# EasyEDA Pro project PCIE拆分卡.epro, schematic Schematic1

## Sheets
1 Gold_X16: Create Date: 2024-06-08; Page Name: Gold_X16; Project Name: P9D_IX_PCIEx16_x8x8; Schematic Name: Schematic1; Update Date: 2024-06-13; Company: 嘉立创EDA; Page Size: A4; Version: V1.0
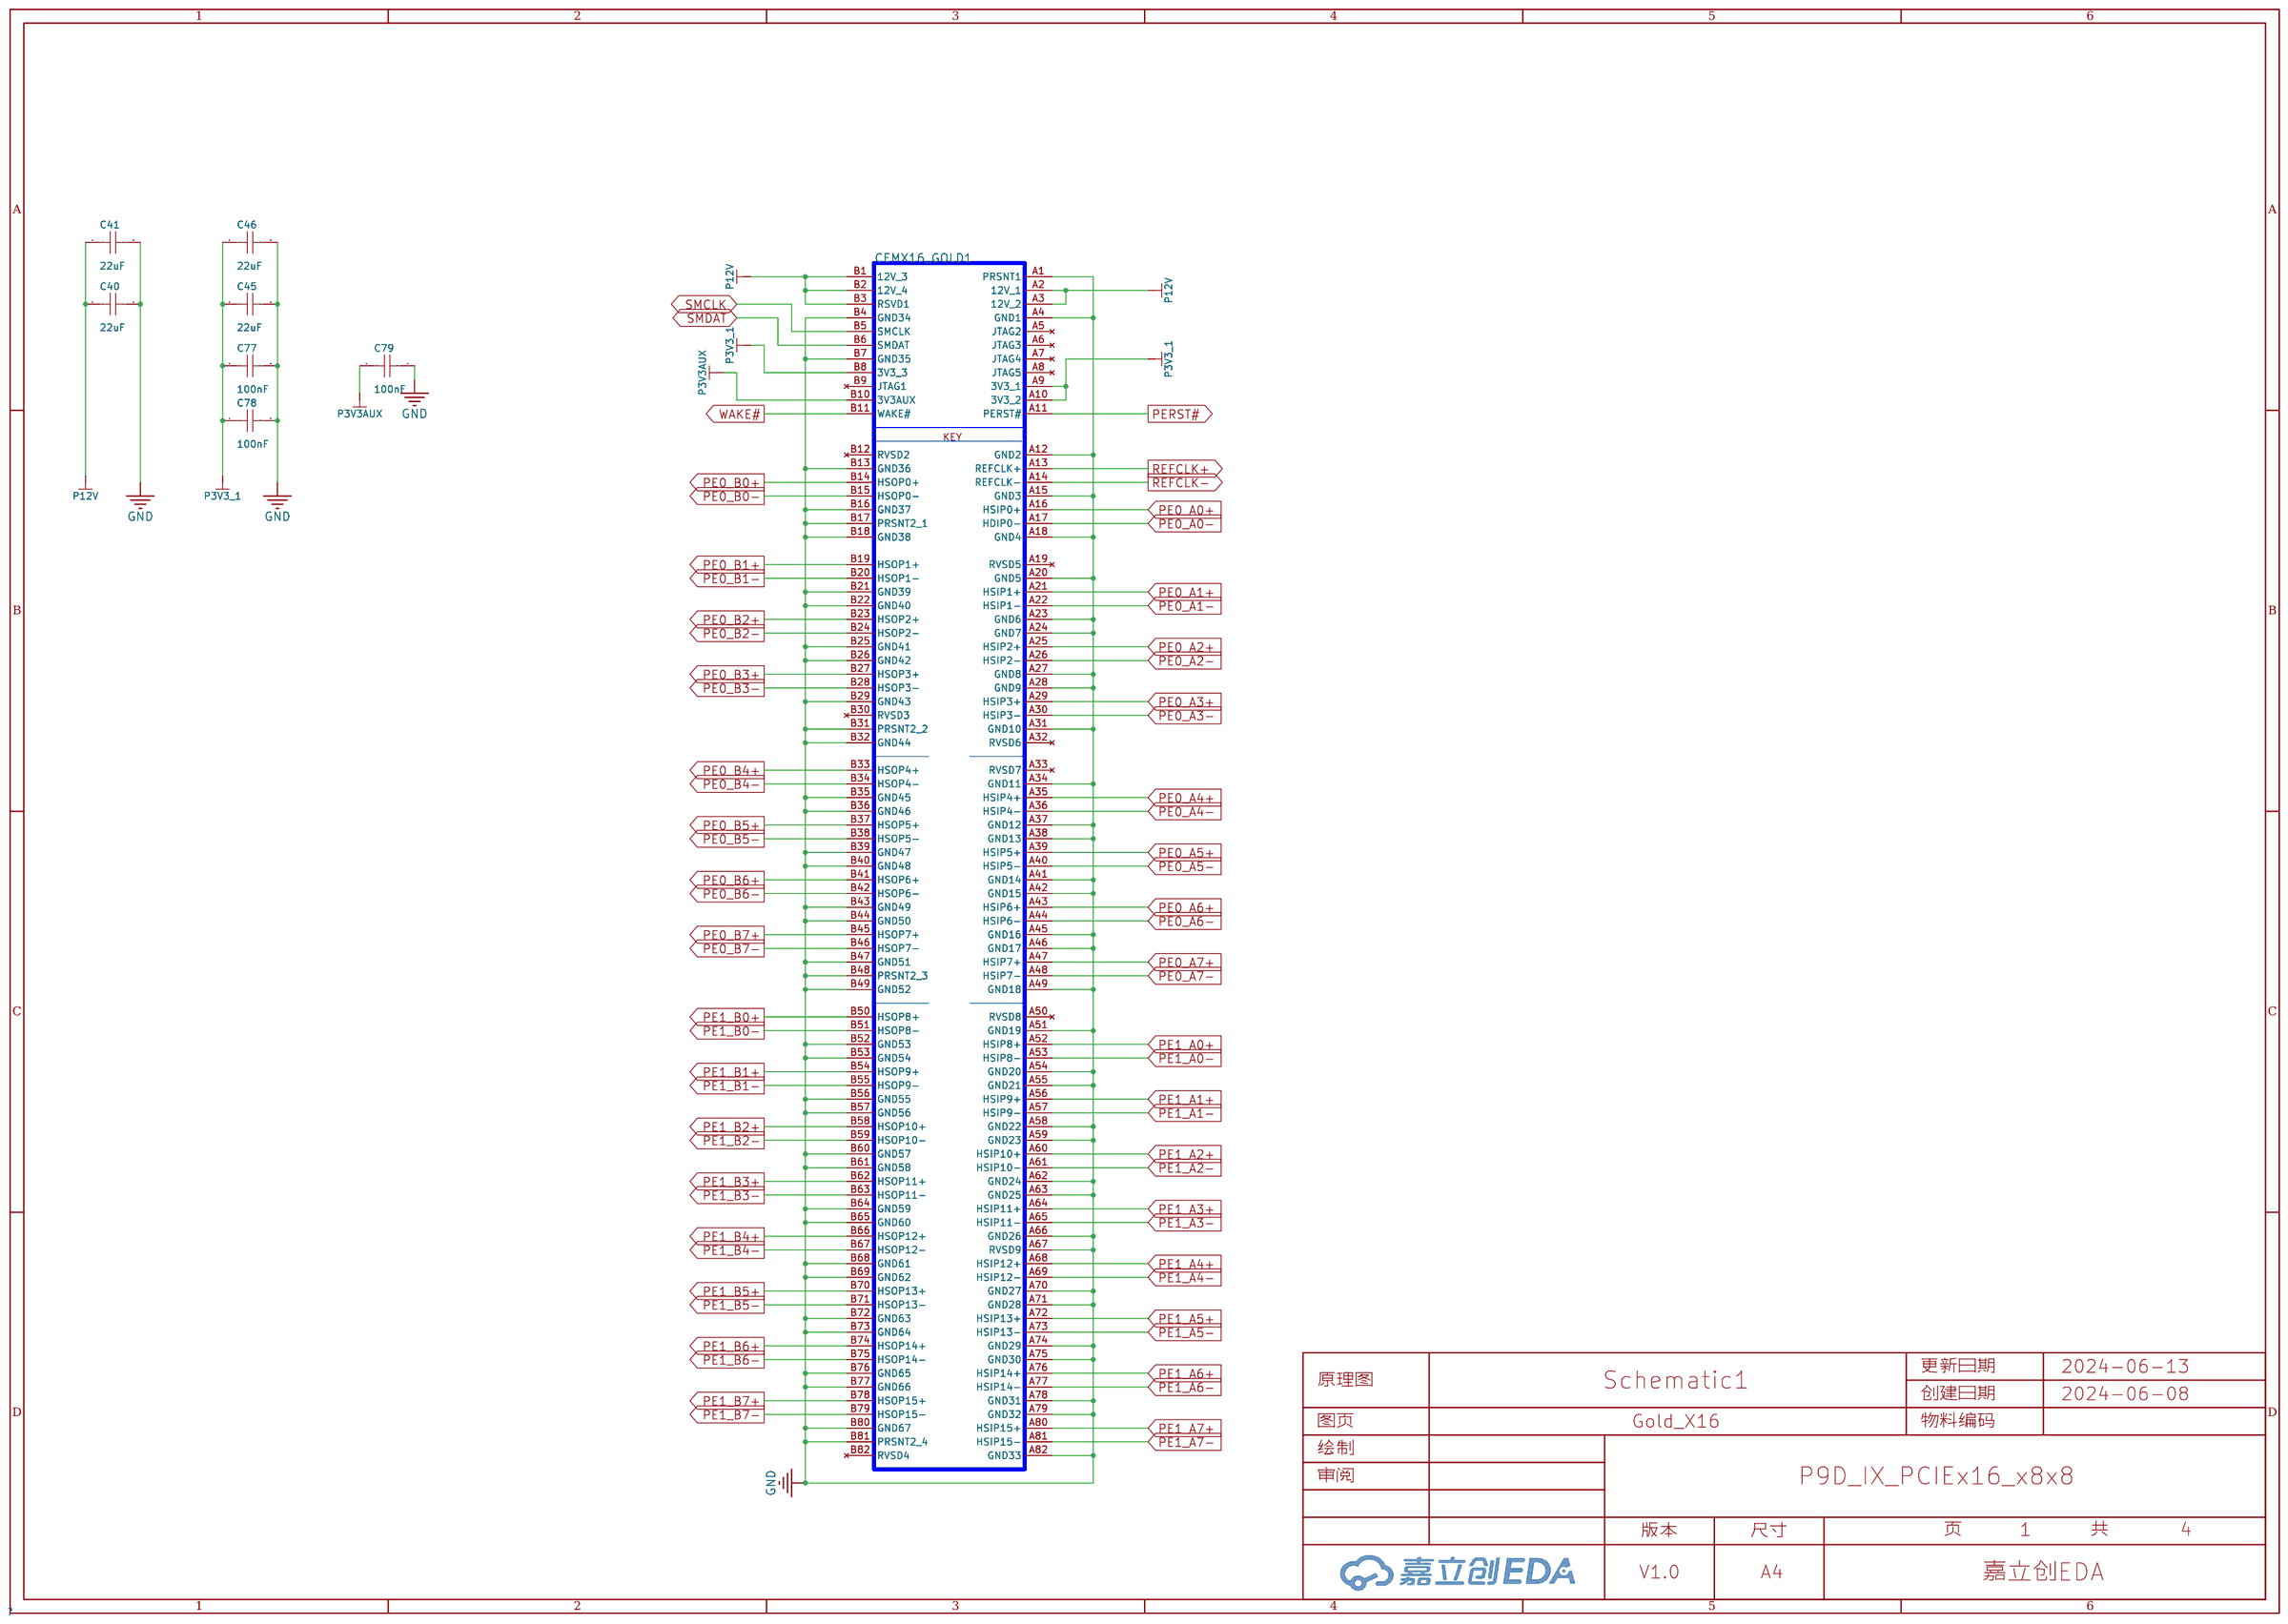
[diagram p0: Gold_X16]
2 CLK: Page Name: CLK; Update Date: 2024-06-12
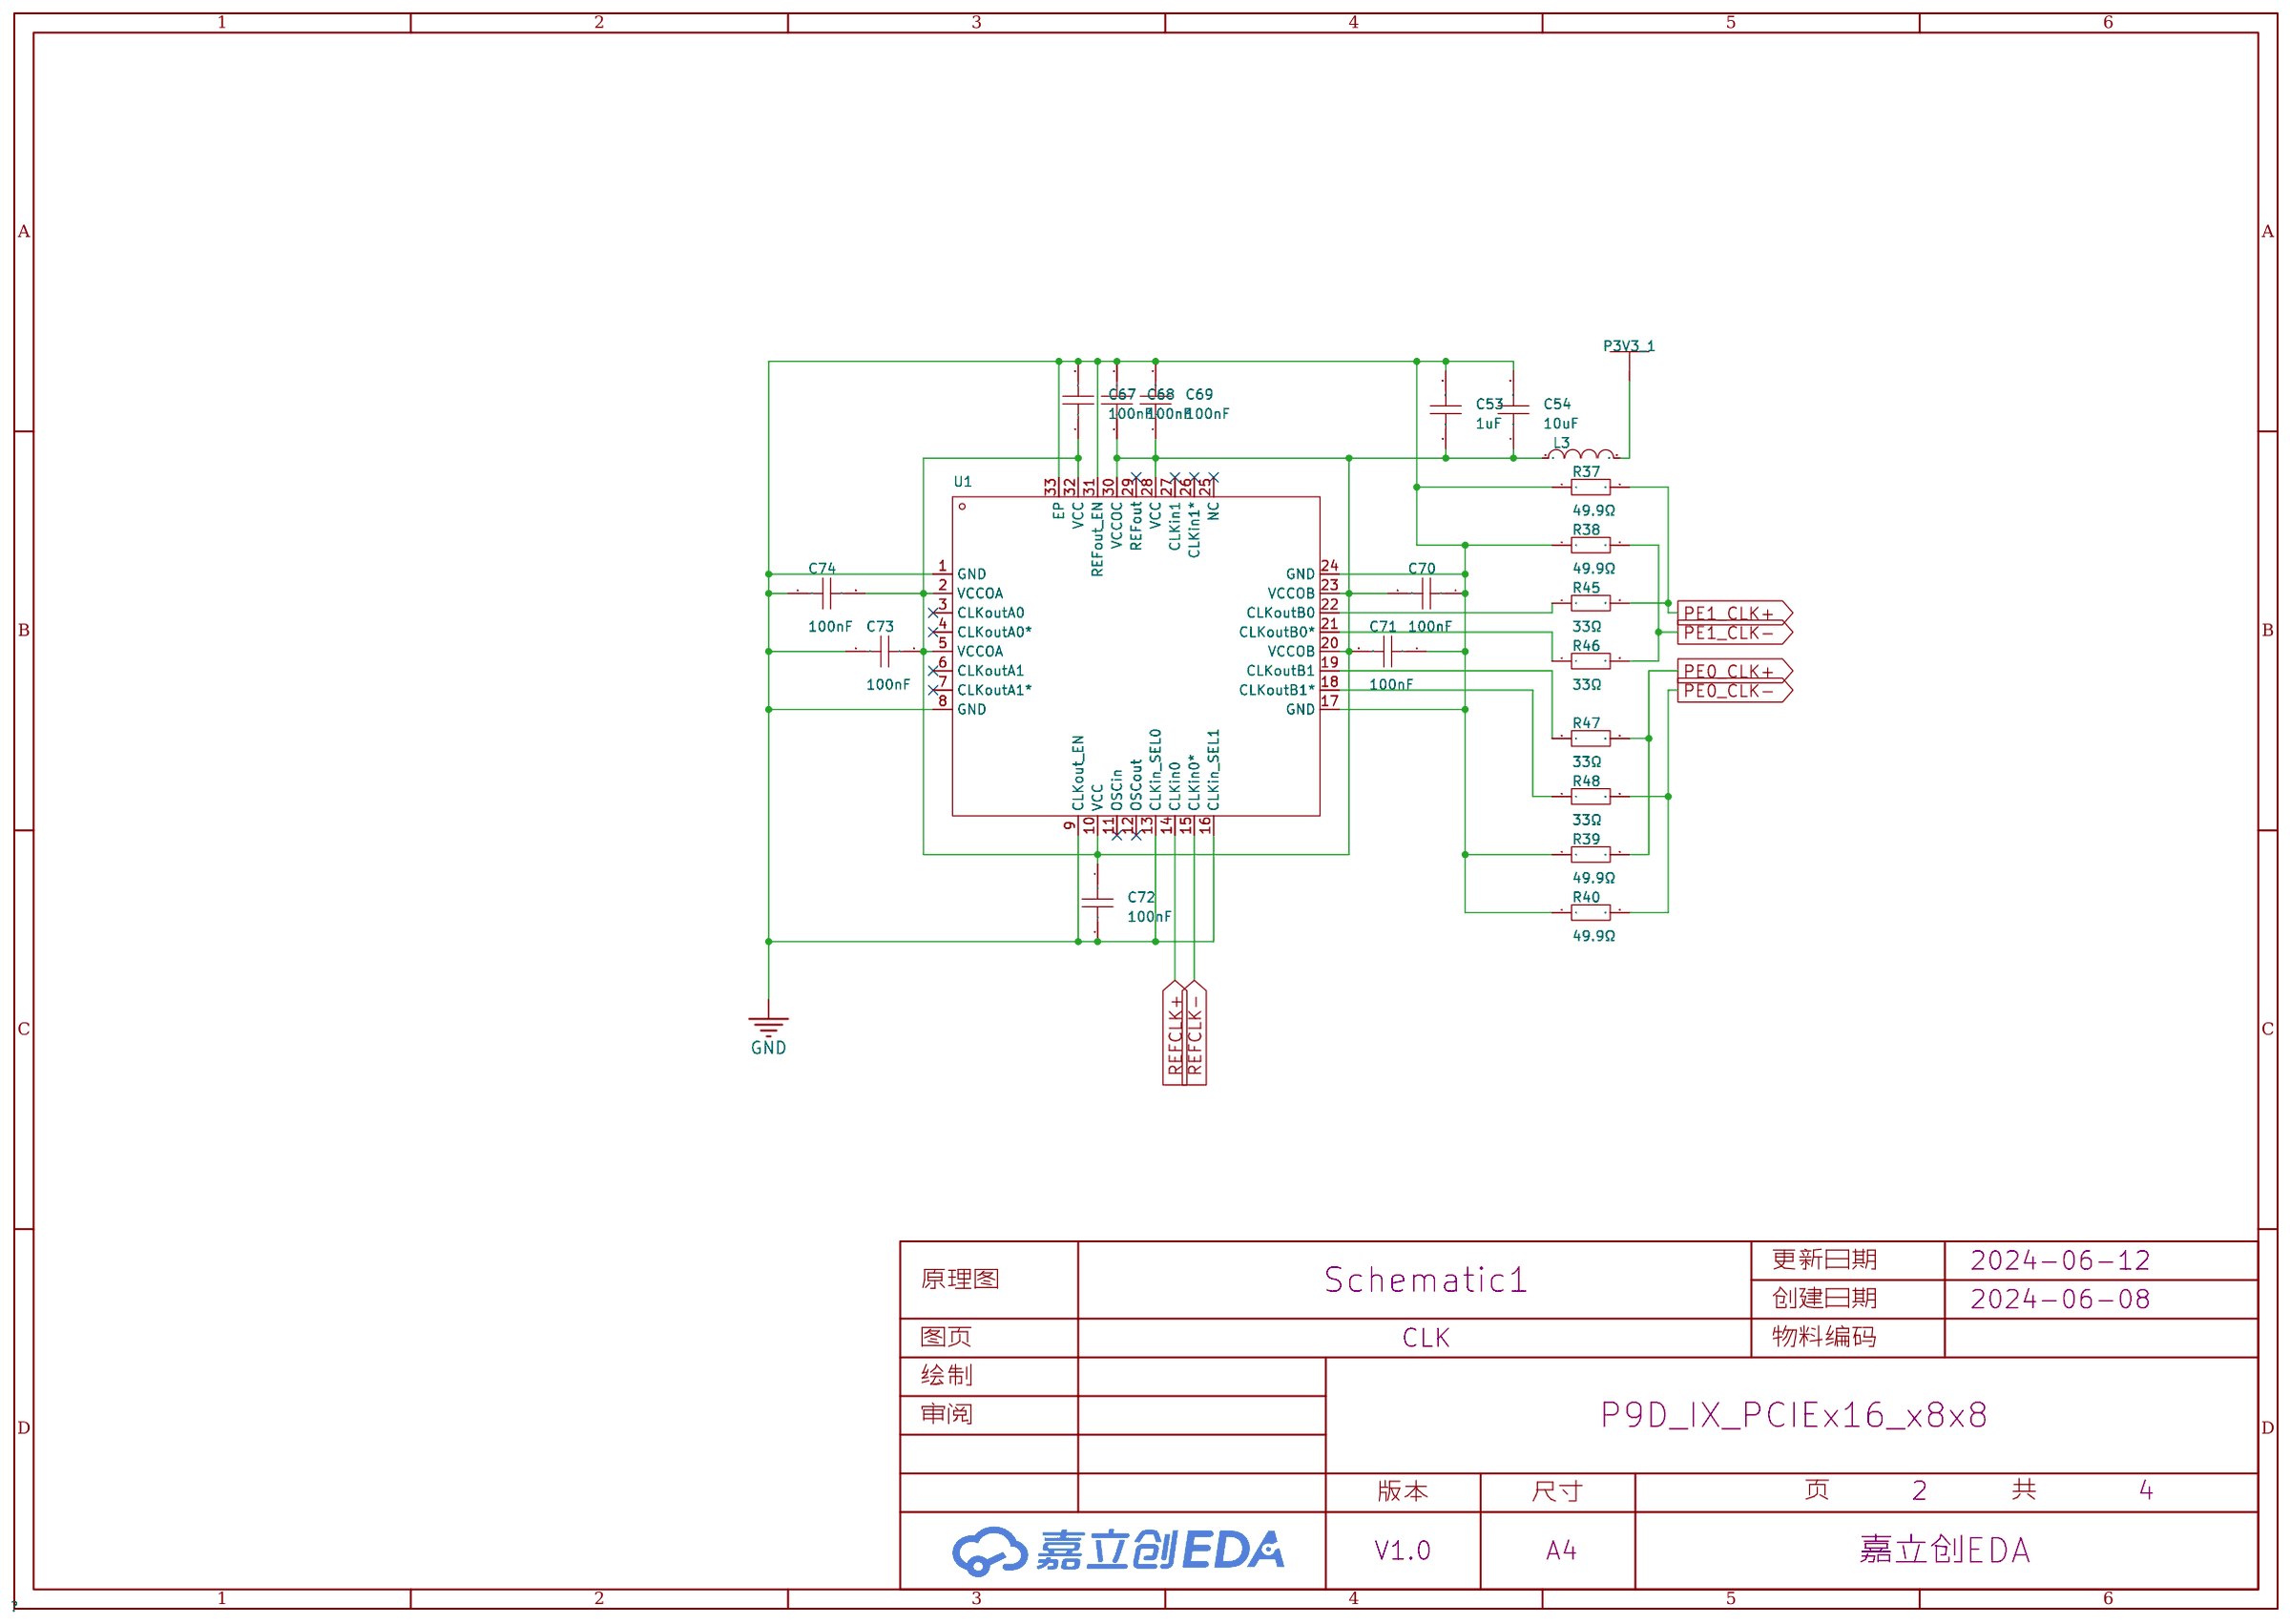
[diagram p1: CLK]
3 PCIEx8_1: Page Name: PCIEx8_1; Update Date: 2024-06-08
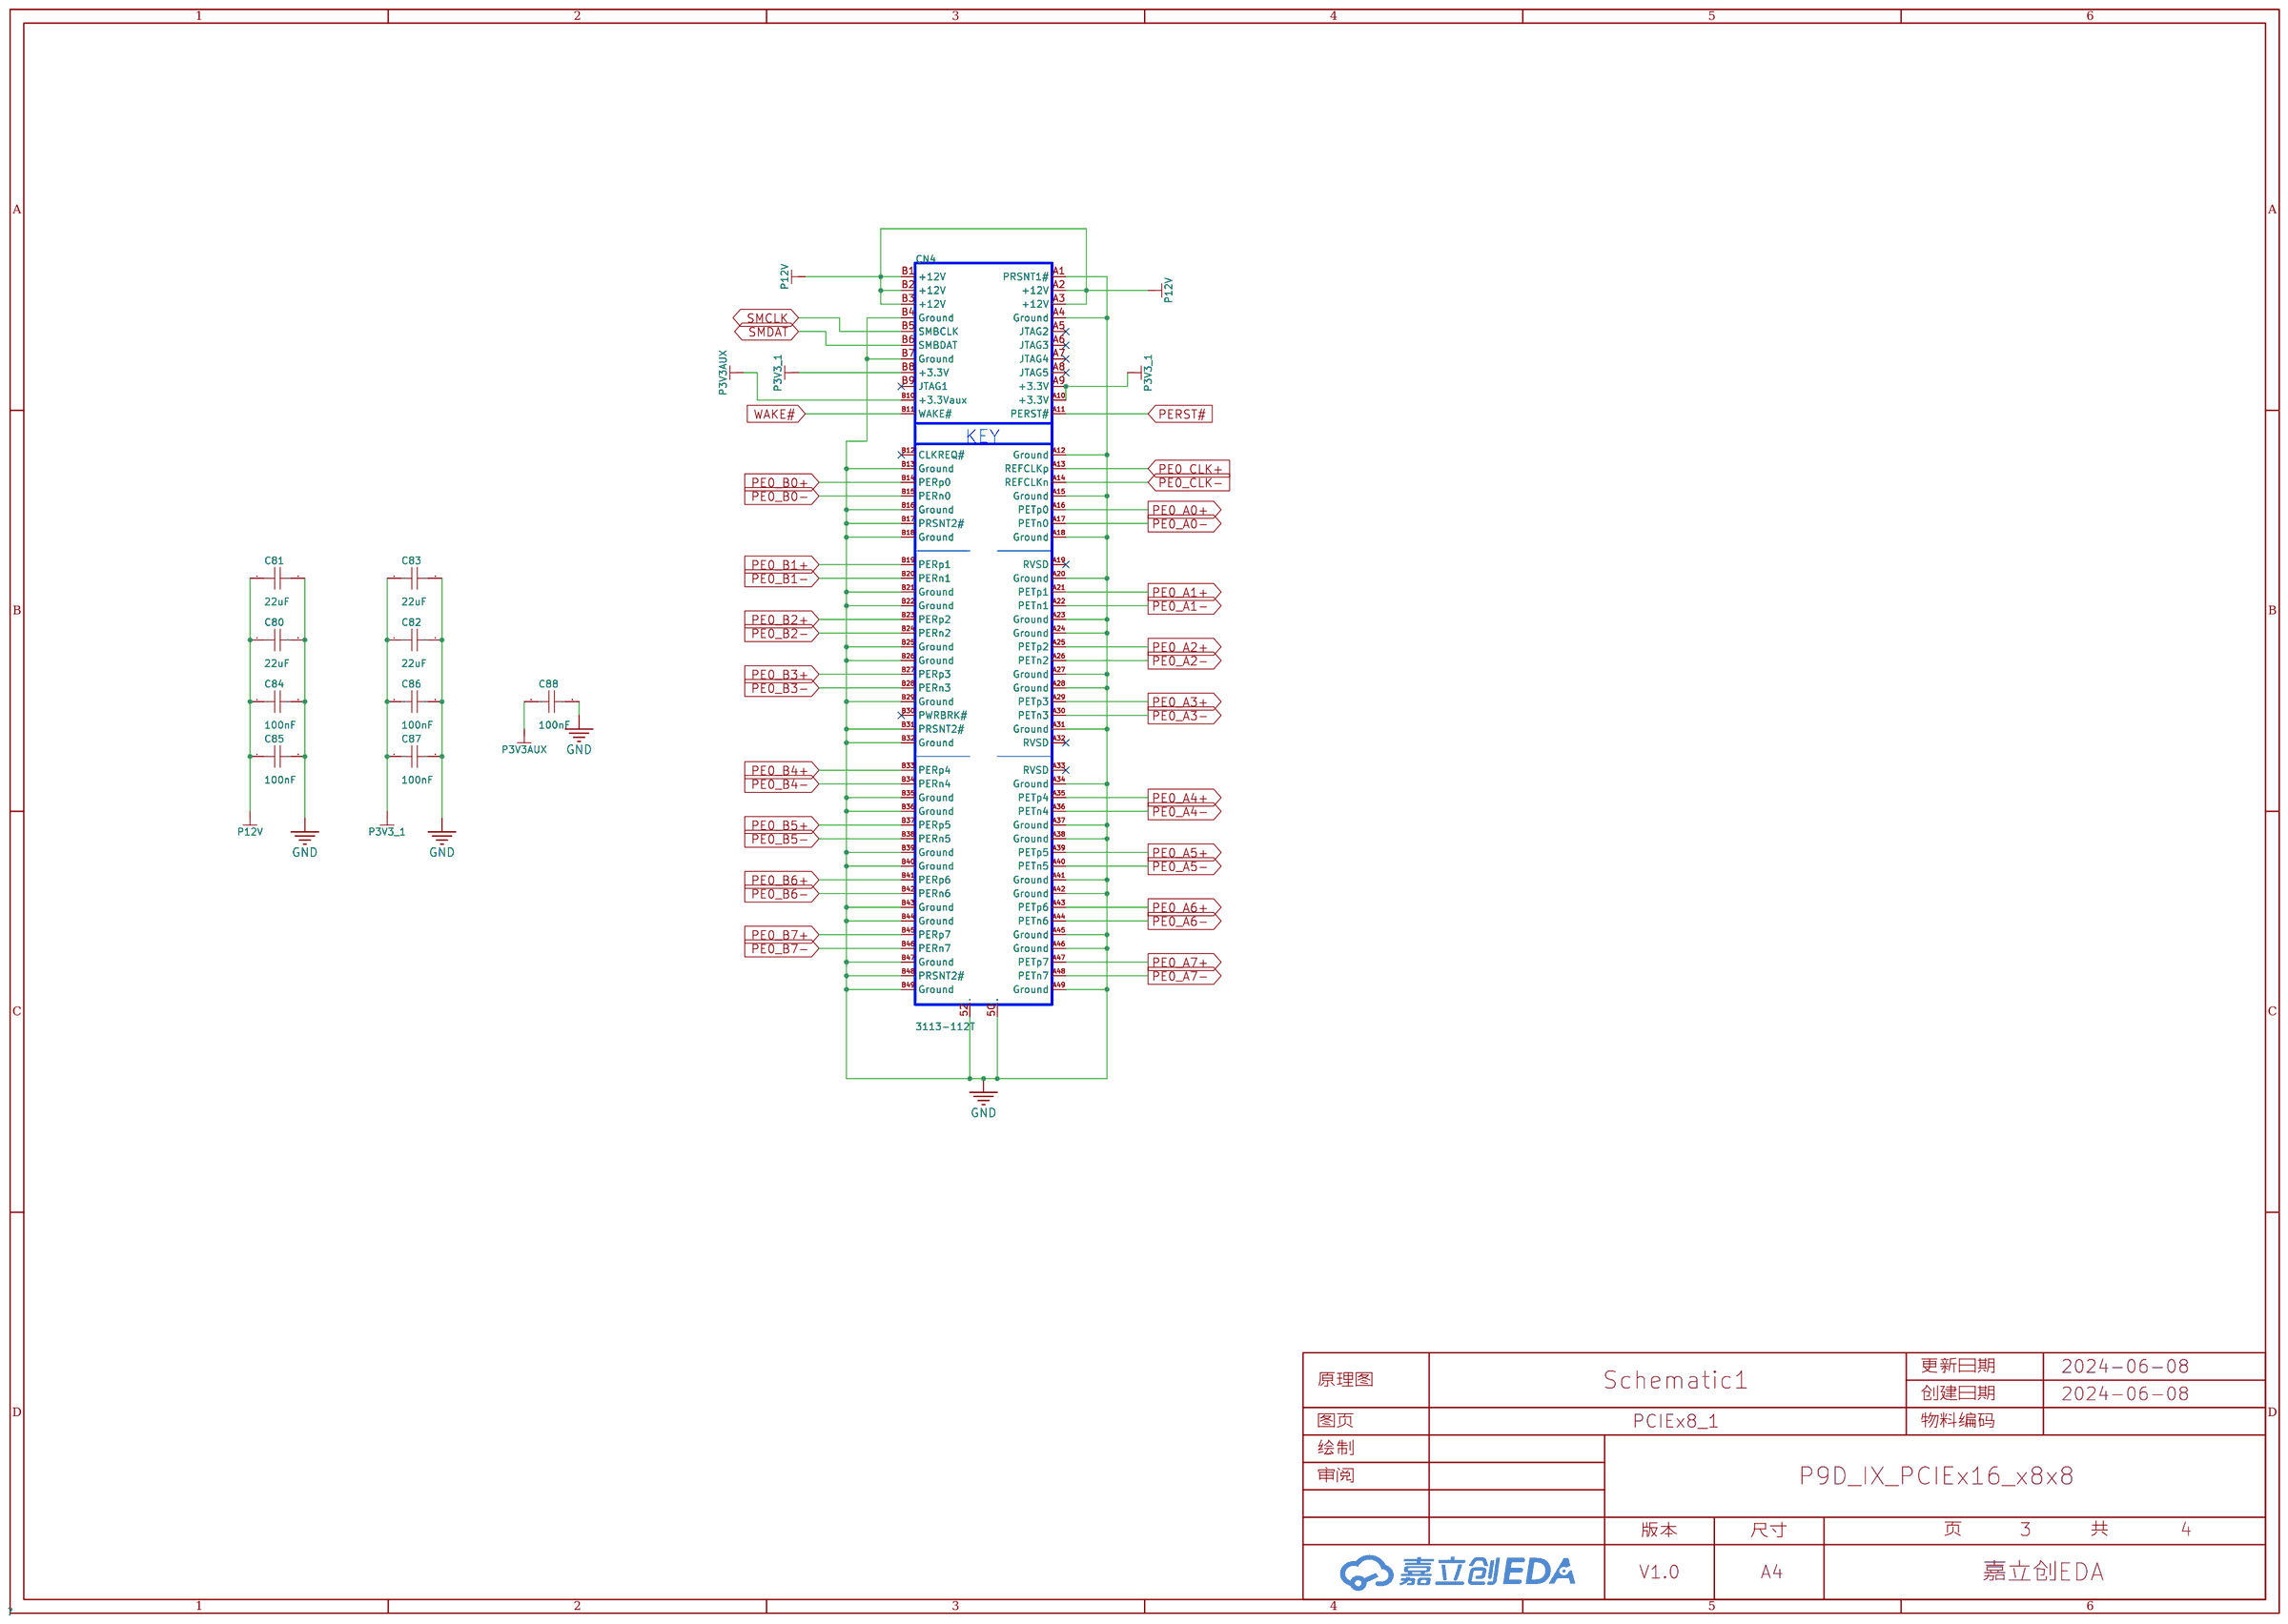
[diagram p2: PCIEx8_1]
4 PCIEx8_2: Page Name: PCIEx8_2; Update Date: 2024-06-08
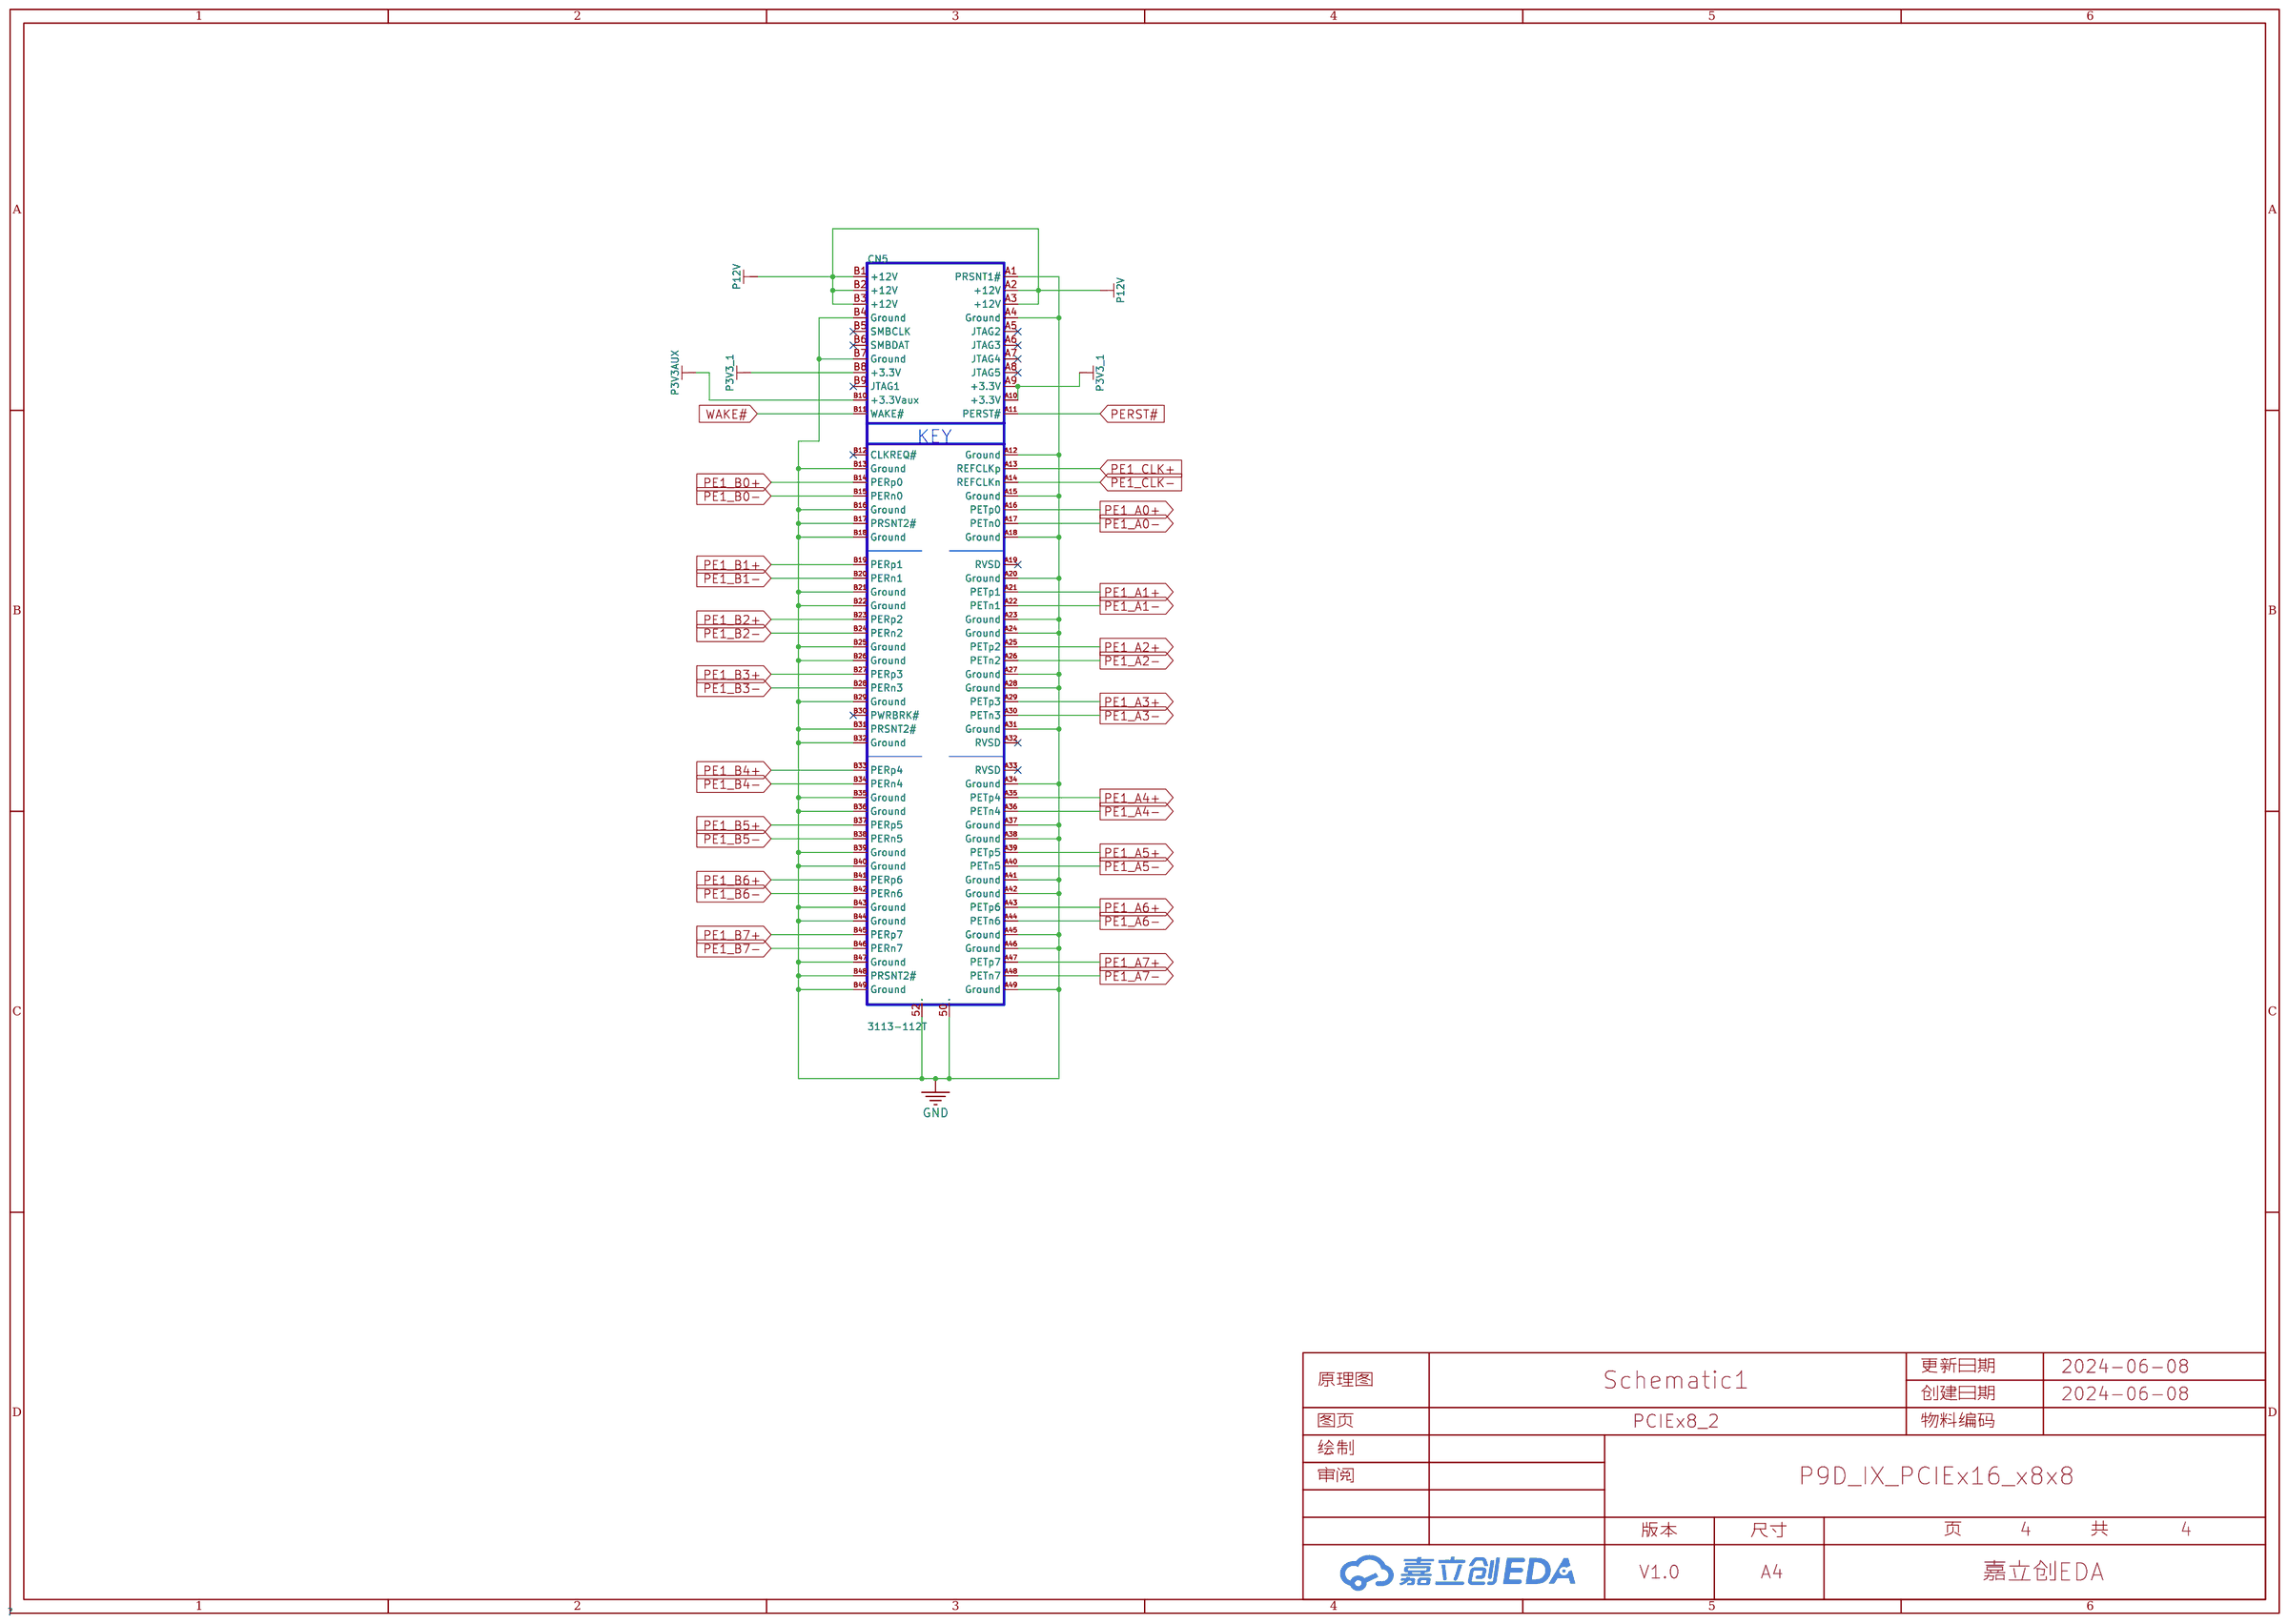
[diagram p3: PCIEx8_2]

## Parts
sheet CLK
C53  1uF  [C0603]
C54  10uF  [C0603]
C67  100nF  [C0402]
C68  100nF  [C0402]
C69  100nF  [C0402]
C70  100nF  [C0402]
C71  100nF  [C0402]
C72  100nF  [C0402]
C73  100nF  [C0402]
C74  100nF  [C0402]
L3  -  [L0805]
R37  49.9Ω  [R0402]
R38  49.9Ω  [R0402]
R39  49.9Ω  [R0402]
R40  49.9Ω  [R0402]
R45  33Ω  [R0402]
R46  33Ω  [R0402]
R47  33Ω  [R0402]
R48  33Ω  [R0402]
U1  -  [WQFN-32_L5.0-W5.0-P0.50-BL-EP]
sheet Gold_X16
C40  22uF  [C0805]
C41  22uF  [C0805]
C45  22uF  [C0805]
C46  22uF  [C0805]
C77  100nF  [C0603]
C78  100nF  [C0603]
C79  100nF  [C0603]
CEMX16_GOLD1  -  [PCIEX16_GOLD]  (no BOM)
sheet PCIEx8_1
C80  22uF  [C0805]
C81  22uF  [C0805]
C82  22uF  [C0805]
C83  22uF  [C0805]
C84  100nF  [C0603]
C85  100nF  [C0603]
C86  100nF  [C0603]
C87  100nF  [C0603]
C88  100nF  [C0603]
CN4  3113-112T  [CONN-SMD_98P-P1.00-V_3133]
sheet PCIEx8_2
CN5  3113-112T  [CONN-SMD_98P-P1.00-V_3133]

## Library data of the parts
C53 = CL10A105KB8NNNC: 容值:1uF;精度:±10%;额定电压:50V;材质(温度系数):X5R;; LCSC Part Name: 1uF ±10% 50V; Supplier Part: C15849; Manufacturer: SAMSUNG(三星); Supplier Footprint: 0603; JLCPCB Part Class: Basic Part; Datasheet: https://atta.szlcsc.com/upload/public/pdf/source/20160218/1457707763339.pdf; Supplier: LCSC; Tolerance: ±10%; Voltage Rated: 50V; Temperature Coefficient: X5R
C54 = CL10A106KP8NNNC: 容值:10uF;精度:±10%;额定电压:10V;材质(温度系数):X5R;; LCSC Part Name: 10uF ±10% 10V; Supplier Part: C19702; Manufacturer: SAMSUNG(三星); Supplier Footprint: 0603; JLCPCB Part Class: Basic Part; Datasheet: https://atta.szlcsc.com/upload/public/pdf/source/20160218/1457707763339.pdf; Supplier: LCSC; Tolerance: ±10%; Voltage Rated: 10V; Temperature Coefficient: X5R
C67-C74 = CL05B104KO5NNNC: 容值:100nF;精度:±10%;额定电压:16V;材质(温度系数):X7R;; LCSC Part Name: 100nF ±10% 16V; Supplier Part: C1525; Manufacturer: SAMSUNG(三星); Supplier Footprint: 0402; JLCPCB Part Class: Basic Part; Datasheet: https://atta.szlcsc.com/upload/public/pdf/source/20160218/1457707763339.pdf; Supplier: LCSC; Tolerance: ±10%; Voltage Rated: 16V; Temperature Coefficient: X7R
L3 = PZ2012D800-3R0TF: 标称阻抗@测试频率:80Ω@100MHz;误差:±25%;直流电阻(RDC):0.04Ω;额定电流:3000mA;电路数:1;; LCSC Part Name: 80Ω@100MHz ±25%; Supplier Part: C12389; Manufacturer: Sunlord(顺络); Supplier Footprint: 0805; JLCPCB Part Class: 扩展库; Datasheet: https://atta.szlcsc.com/upload/public/pdf/source/20210816/2FE48A83668C9496AD98DE44B7F0FA96.pdf; Supplier: LCSC; Impedance @ Frequency: 80Ω@100MHz; Tolerance: ±25%; DC Resistance: 0.04Ω; Current Rating: 3000mA; Circuits: 1
R37-R40 = ERA2AEB49R9X: 电阻类型:薄膜电阻;阻值:49.9Ω;精度:±0.1%;功率:63mW;温度系数:±25ppm/℃;; LCSC Part Name: 49.9Ω ±0.1% 63mW 薄膜电阻; Supplier Part: C490832; Manufacturer: PANASONIC(松下); Supplier Footprint: 0402; JLCPCB Part Class: Extended Part; Datasheet: https://atta.szlcsc.com/upload/public/pdf/source/20200407/C490832_91E847F7316FF40FBA654E9B1D34990D.pdf; Supplier: LCSC; Type: 薄膜电阻; Tolerance: ±0.1%; Power(Watts): 63mW; Temperature Coefficient: ±25ppm/℃; Operating Temperature Range: -55℃~+155℃
R45-R48 = RT0402BRD0733RL: 电阻类型:薄膜电阻;阻值:33Ω;精度:±0.1%;功率:63mW;温度系数:±25ppm/℃;; LCSC Part Name: 薄膜电阻 33Ω ±0.1% 63mW; Supplier Part: C852729; Manufacturer: YAGEO(国巨); Supplier Footprint: 0402; JLCPCB Part Class: Extended Part; Datasheet: https://atta.szlcsc.com/upload/public/pdf/source/20200610/C326738_5639A9F1B6EB6E4AE2197577D3456E7F.pdf; Supplier: LCSC; Type: 薄膜电阻; Tolerance: ±0.1%; Power(Watts): 63mW; Temperature Coefficient: ±25ppm/℃; Operating Temperature Range: -55℃~+155℃
U1 = LMK00334RTVR: LMK00334 LMK00334 4 输出 PCIe Gen1/Gen2/Gen3 时钟缓冲器/电平转换器; Supplier Part: C201644; Manufacturer: TI(德州仪器); Supplier Footprint: WQFN-32; JLCPCB Part Class: Extended Part; Datasheet: https://atta.szlcsc.com/upload/public/pdf/source/20180329/C201644_E52AC8D9AC4553EBBD85BA4FA6BF53AD.pdf; Supplier: LCSC
C40 C41 C45 C46 C80-C83 = CL21A226MAQNNNE: 容值:22uF;精度:±20%;额定电压:25V;材质(温度系数):X5R;; LCSC Part Name: 22uF ±20% 25V; Supplier Part: C45783; Manufacturer: SAMSUNG(三星); Supplier Footprint: 0805; JLCPCB Part Class: Basic Part; Datasheet: https://atta.szlcsc.com/upload/public/pdf/source/20160218/1457707763339.pdf; Supplier: LCSC; Tolerance: ±20%; Voltage Rated: 25V; Temperature Coefficient: X5R
C77-C79 C84-C88 = CC0603KRX7R9BB104: 容值:100nF;精度:±10%;额定电压:50V;材质(温度系数):X7R;; LCSC Part Name: 100nF ±10% 50V; Supplier Part: C14663; Manufacturer: YAGEO(国巨); Supplier Footprint: 0603; JLCPCB Part Class: Basic Part; Datasheet: https://atta.szlcsc.com/upload/public/pdf/source/20180910/C282072_33301C7F631E79921B82A8DAC6BCC5B3.pdf; Supplier: LCSC; Tolerance: ±10%; Voltage Rated: 50V; Temperature Coefficient: X7R
CEMX16_GOLD1 = pciex16_gold: PCIEX16金手指; Check: false
CN4 CN5 = PCIE_X8: 连接器类型:PCI-E;间距:1mm;引脚总数:98P;安装方式:立贴;工作温度范围:-40℃~+85℃;; LCSC Part Name: 1mm P数:98P 黑色; Supplier Part: C404103; Manufacturer: UMaxconn(友贸); Supplier Footprint: SMD,P=1mm; JLCPCB Part Class: 扩展库; Datasheet: https://atta.szlcsc.com/upload/public/pdf/source/20190717/C404104_93EDAB824316E574F3C31B947EAD24AB.pdf; Supplier: LCSC; Connector Type: PCI-E; Pitch: 1mm; Number of Pins: 98P; Mounting Style: 立贴; Height Above Board: 11.25mm; Contact Material: 铜合金; Contact Plating: 金; Operating Temperature Range: -40℃~+85℃

## Nets
GND: C40.2 C41.2 C45.2 C46.2 C53.2 C54.2 C67.2 C68.2 C69.2 C70.1 C71.1 C72.2 C73.1 C74.1 C77.2 C78.2 C79.2 C80.2 C81.2 C82.2 C83.2 C84.2 C85.2 C86.2 C87.2 C88.2 CEMX16_GOLD1.A1(PRSNT1) CEMX16_GOLD1.A4(GND1) CEMX16_GOLD1.A12(GND2) CEMX16_GOLD1.A15(GND3) CEMX16_GOLD1.A18(GND4) CEMX16_GOLD1.A20(GND5) CEMX16_GOLD1.A23(GND6) CEMX16_GOLD1.A24(GND7) CEMX16_GOLD1.A27(GND8) CEMX16_GOLD1.A28(GND9) CEMX16_GOLD1.A31(GND10) CEMX16_GOLD1.A34(GND11) CEMX16_GOLD1.A37(GND12) CEMX16_GOLD1.A38(GND13) CEMX16_GOLD1.A41(GND14) CEMX16_GOLD1.A42(GND15) CEMX16_GOLD1.A45(GND16) CEMX16_GOLD1.A46(GND17) CEMX16_GOLD1.A49(GND18) CEMX16_GOLD1.A51(GND19) CEMX16_GOLD1.A54(GND20) CEMX16_GOLD1.A55(GND21) CEMX16_GOLD1.A58(GND22) CEMX16_GOLD1.A59(GND23) CEMX16_GOLD1.A62(GND24) CEMX16_GOLD1.A63(GND25) CEMX16_GOLD1.A66(GND26) CEMX16_GOLD1.A67(RVSD9) CEMX16_GOLD1.A70(GND27) CEMX16_GOLD1.A71(GND28) CEMX16_GOLD1.A74(GND29) CEMX16_GOLD1.A75(GND30) CEMX16_GOLD1.A78(GND31) CEMX16_GOLD1.A79(GND32) CEMX16_GOLD1.A82(GND33) CEMX16_GOLD1.B4(GND34) CEMX16_GOLD1.B7(GND35) CEMX16_GOLD1.B13(GND36) CEMX16_GOLD1.B16(GND37) CEMX16_GOLD1.B17(PRSNT2_1) CEMX16_GOLD1.B18(GND38) CEMX16_GOLD1.B21(GND39) CEMX16_GOLD1.B22(GND40) CEMX16_GOLD1.B25(GND41) CEMX16_GOLD1.B26(GND42) CEMX16_GOLD1.B29(GND43) CEMX16_GOLD1.B31(PRSNT2_2) CEMX16_GOLD1.B32(GND44) CEMX16_GOLD1.B35(GND45) CEMX16_GOLD1.B36(GND46) CEMX16_GOLD1.B39(GND47) CEMX16_GOLD1.B40(GND48) CEMX16_GOLD1.B43(GND49) CEMX16_GOLD1.B44(GND50) CEMX16_GOLD1.B47(GND51) CEMX16_GOLD1.B48(PRSNT2_3) CEMX16_GOLD1.B49(GND52) CEMX16_GOLD1.B52(GND53) CEMX16_GOLD1.B53(GND54) CEMX16_GOLD1.B56(GND55) CEMX16_GOLD1.B57(GND56) CEMX16_GOLD1.B60(GND57) CEMX16_GOLD1.B61(GND58) CEMX16_GOLD1.B64(GND59) CEMX16_GOLD1.B65(GND60) CEMX16_GOLD1.B68(GND61) CEMX16_GOLD1.B69(GND62) CEMX16_GOLD1.B72(GND63) CEMX16_GOLD1.B73(GND64) CEMX16_GOLD1.B76(GND65) CEMX16_GOLD1.B77(GND66) CEMX16_GOLD1.B80(GND67) CEMX16_GOLD1.B81(PRSNT2_4) CN4.50(GND) CN4.52(GND) CN4.A1(PRSNT1#) CN4.A4(Ground) CN4.A12(Ground) CN4.A15(Ground) CN4.A18(Ground) CN4.A20(Ground) CN4.A23(Ground) CN4.A24(Ground) CN4.A27(Ground) CN4.A28(Ground) CN4.A31(Ground) CN4.A34(Ground) CN4.A37(Ground) CN4.A38(Ground) CN4.A41(Ground) CN4.A42(Ground) CN4.A45(Ground) CN4.A46(Ground) CN4.A49(Ground) CN4.B4(Ground) CN4.B7(Ground) CN4.B13(Ground) CN4.B16(Ground) CN4.B17(PRSNT2#) CN4.B18(Ground) CN4.B21(Ground) CN4.B22(Ground) CN4.B25(Ground) CN4.B26(Ground) CN4.B29(Ground) CN4.B31(PRSNT2#) CN4.B32(Ground) CN4.B35(Ground) CN4.B36(Ground) CN4.B39(Ground) CN4.B40(Ground) CN4.B43(Ground) CN4.B44(Ground) CN4.B47(Ground) CN4.B48(PRSNT2#) CN4.B49(Ground) CN5.50(GND) CN5.52(GND) CN5.A1(PRSNT1#) CN5.A4(Ground) CN5.A12(Ground) CN5.A15(Ground) CN5.A18(Ground) CN5.A20(Ground) CN5.A23(Ground) CN5.A24(Ground) CN5.A27(Ground) CN5.A28(Ground) CN5.A31(Ground) CN5.A34(Ground) CN5.A37(Ground) CN5.A38(Ground) CN5.A41(Ground) CN5.A42(Ground) CN5.A45(Ground) CN5.A46(Ground) CN5.A49(Ground) CN5.B4(Ground) CN5.B7(Ground) CN5.B13(Ground) CN5.B16(Ground) CN5.B17(PRSNT2#) CN5.B18(Ground) CN5.B21(Ground) CN5.B22(Ground) CN5.B25(Ground) CN5.B26(Ground) CN5.B29(Ground) CN5.B31(PRSNT2#) CN5.B32(Ground) CN5.B35(Ground) CN5.B36(Ground) CN5.B39(Ground) CN5.B40(Ground) CN5.B43(Ground) CN5.B44(Ground) CN5.B47(Ground) CN5.B48(PRSNT2#) CN5.B49(Ground) R37.1 R38.1 R39.1 R40.1 U1.1(GND) U1.8(GND) U1.9(CLKout_EN) U1.13(CLKin_SEL0) U1.16(CLKin_SEL1) U1.17(GND) U1.24(GND) U1.31(REFout_EN) U1.33(EP)
P3V3_1: C45.1 C46.1 C77.1 C78.1 C82.1 C83.1 C86.1 C87.1 CEMX16_GOLD1.A9(3V3_1) CEMX16_GOLD1.A10(3V3_2) CEMX16_GOLD1.B8(3V3_3) CN4.A9(+3.3V) CN4.A10(+3.3V) CN4.B8(+3.3V) CN5.A9(+3.3V) CN5.A10(+3.3V) CN5.B8(+3.3V) L3.2
P3V3AUX: C79.1 C88.1 CEMX16_GOLD1.B10(3V3AUX) CN4.B10(+3.3Vaux) CN5.B10(+3.3Vaux)
P12V: C40.1 C41.1 C80.1 C81.1 C84.1 C85.1 CEMX16_GOLD1.A2(12V_1) CEMX16_GOLD1.A3(12V_2) CEMX16_GOLD1.B1(12V_3) CEMX16_GOLD1.B2(12V_4) CEMX16_GOLD1.B3(RSVD1) CN4.A2(+12V) CN4.A3(+12V) CN4.B1(+12V) CN4.B2(+12V) CN4.B3(+12V) CN5.A2(+12V) CN5.A3(+12V) CN5.B1(+12V) CN5.B2(+12V) CN5.B3(+12V)
PE0_A0+: CEMX16_GOLD1.A16(HSIP0+) CN4.A16(PETp0)
PE0_A0-: CEMX16_GOLD1.A17(HDIP0-) CN4.A17(PETn0)
PE0_A1+: CEMX16_GOLD1.A21(HSIP1+) CN4.A21(PETp1)
PE0_A1-: CEMX16_GOLD1.A22(HSIP1-) CN4.A22(PETn1)
PE0_A2+: CEMX16_GOLD1.A25(HSIP2+) CN4.A25(PETp2)
PE0_A2-: CEMX16_GOLD1.A26(HSIP2-) CN4.A26(PETn2)
PE0_A3+: CEMX16_GOLD1.A29(HSIP3+) CN4.A29(PETp3)
PE0_A3-: CEMX16_GOLD1.A30(HSIP3-) CN4.A30(PETn3)
PE0_A4+: CEMX16_GOLD1.A35(HSIP4+) CN4.A35(PETp4)
PE0_A4-: CEMX16_GOLD1.A36(HSIP4-) CN4.A36(PETn4)
PE0_A5+: CEMX16_GOLD1.A39(HSIP5+) CN4.A39(PETp5)
PE0_A5-: CEMX16_GOLD1.A40(HSIP5-) CN4.A40(PETn5)
PE0_A6+: CEMX16_GOLD1.A43(HSIP6+) CN4.A43(PETp6)
PE0_A6-: CEMX16_GOLD1.A44(HSIP6-) CN4.A44(PETn6)
PE0_A7+: CEMX16_GOLD1.A47(HSIP7+) CN4.A47(PETp7)
PE0_A7-: CEMX16_GOLD1.A48(HSIP7-) CN4.A48(PETn7)
PE0_B0+: CEMX16_GOLD1.B14(HSOP0+) CN4.B14(PERp0)
PE0_B0-: CEMX16_GOLD1.B15(HSOP0-) CN4.B15(PERn0)
PE0_B1+: CEMX16_GOLD1.B19(HSOP1+) CN4.B19(PERp1)
PE0_B1-: CEMX16_GOLD1.B20(HSOP1-) CN4.B20(PERn1)
PE0_B2+: CEMX16_GOLD1.B23(HSOP2+) CN4.B23(PERp2)
PE0_B2-: CEMX16_GOLD1.B24(HSOP2-) CN4.B24(PERn2)
PE0_B3+: CEMX16_GOLD1.B27(HSOP3+) CN4.B27(PERp3)
PE0_B3-: CEMX16_GOLD1.B28(HSOP3-) CN4.B28(PERn3)
PE0_B4+: CEMX16_GOLD1.B33(HSOP4+) CN4.B33(PERp4)
PE0_B4-: CEMX16_GOLD1.B34(HSOP4-) CN4.B34(PERn4)
PE0_B5+: CEMX16_GOLD1.B37(HSOP5+) CN4.B37(PERp5)
PE0_B5-: CEMX16_GOLD1.B38(HSOP5-) CN4.B38(PERn5)
PE0_B6+: CEMX16_GOLD1.B41(HSOP6+) CN4.B41(PERp6)
PE0_B6-: CEMX16_GOLD1.B42(HSOP6-) CN4.B42(PERn6)
PE0_B7+: CEMX16_GOLD1.B45(HSOP7+) CN4.B45(PERp7)
PE0_B7-: CEMX16_GOLD1.B46(HSOP7-) CN4.B46(PERn7)
PE0_CLK+: CN4.A13(REFCLKp) R39.2 R47.2
PE0_CLK-: CN4.A14(REFCLKn) R40.2 R48.2
PE1_A0+: CEMX16_GOLD1.A52(HSIP8+) CN5.A16(PETp0)
PE1_A0-: CEMX16_GOLD1.A53(HSIP8-) CN5.A17(PETn0)
PE1_A1+: CEMX16_GOLD1.A56(HSIP9+) CN5.A21(PETp1)
PE1_A1-: CEMX16_GOLD1.A57(HSIP9-) CN5.A22(PETn1)
PE1_A2+: CEMX16_GOLD1.A60(HSIP10+) CN5.A25(PETp2)
PE1_A2-: CEMX16_GOLD1.A61(HSIP10-) CN5.A26(PETn2)
PE1_A3+: CEMX16_GOLD1.A64(HSIP11+) CN5.A29(PETp3)
PE1_A3-: CEMX16_GOLD1.A65(HSIP11-) CN5.A30(PETn3)
PE1_A4+: CEMX16_GOLD1.A68(HSIP12+) CN5.A35(PETp4)
PE1_A4-: CEMX16_GOLD1.A69(HSIP12-) CN5.A36(PETn4)
PE1_A5+: CEMX16_GOLD1.A72(HSIP13+) CN5.A39(PETp5)
PE1_A5-: CEMX16_GOLD1.A73(HSIP13-) CN5.A40(PETn5)
PE1_A6+: CEMX16_GOLD1.A76(HSIP14+) CN5.A43(PETp6)
PE1_A6-: CEMX16_GOLD1.A77(HSIP14-) CN5.A44(PETn6)
PE1_A7+: CEMX16_GOLD1.A80(HSIP15+) CN5.A47(PETp7)
PE1_A7-: CEMX16_GOLD1.A81(HSIP15-) CN5.A48(PETn7)
PE1_B0+: CEMX16_GOLD1.B50(HSOP8+) CN5.B14(PERp0)
PE1_B0-: CEMX16_GOLD1.B51(HSOP8-) CN5.B15(PERn0)
PE1_B1+: CEMX16_GOLD1.B54(HSOP9+) CN5.B19(PERp1)
PE1_B1-: CEMX16_GOLD1.B55(HSOP9-) CN5.B20(PERn1)
PE1_B2+: CEMX16_GOLD1.B58(HSOP10+) CN5.B23(PERp2)
PE1_B2-: CEMX16_GOLD1.B59(HSOP10-) CN5.B24(PERn2)
PE1_B3+: CEMX16_GOLD1.B62(HSOP11+) CN5.B27(PERp3)
PE1_B3-: CEMX16_GOLD1.B63(HSOP11-) CN5.B28(PERn3)
PE1_B4+: CEMX16_GOLD1.B66(HSOP12+) CN5.B33(PERp4)
PE1_B4-: CEMX16_GOLD1.B67(HSOP12-) CN5.B34(PERn4)
PE1_B5+: CEMX16_GOLD1.B70(HSOP13+) CN5.B37(PERp5)
PE1_B5-: CEMX16_GOLD1.B71(HSOP13-) CN5.B38(PERn5)
PE1_B6+: CEMX16_GOLD1.B74(HSOP14+) CN5.B41(PERp6)
PE1_B6-: CEMX16_GOLD1.B75(HSOP14-) CN5.B42(PERn6)
PE1_B7+: CEMX16_GOLD1.B78(HSOP15+) CN5.B45(PERp7)
PE1_B7-: CEMX16_GOLD1.B79(HSOP15-) CN5.B46(PERn7)
PE1_CLK+: CN5.A13(REFCLKp) R37.2 R45.2
PE1_CLK-: CN5.A14(REFCLKn) R38.2 R46.2
PERST#: CEMX16_GOLD1.A11(PERST#) CN4.A11(PERST#) CN5.A11(PERST#)
REFCLK+: CEMX16_GOLD1.A13(REFCLK+) U1.14(CLKin0)
REFCLK-: CEMX16_GOLD1.A14(REFCLK-) U1.15(CLKin0*)
SMCLK: CEMX16_GOLD1.B5(SMCLK) CN4.B5(SMBCLK)
SMDAT: CEMX16_GOLD1.B6(SMDAT) CN4.B6(SMBDAT)
WAKE#: CEMX16_GOLD1.B11(WAKE#) CN4.B11(WAKE#) CN5.B11(WAKE#)
$2N1172: R46.1 U1.21(CLKoutB0*)
$2N1173: R47.1 U1.19(CLKoutB1)
$2N1174: R48.1 U1.18(CLKoutB1*)
$2N1181: C53.1 C54.1 C67.1 C68.1 C69.1 C70.2 C71.2 C72.1 C73.2 C74.2 L3.1 U1.2(VCCOA) U1.5(VCCOA) U1.10(VCC) U1.20(VCCOB) U1.23(VCCOB) U1.28(VCC) U1.30(VCCOC) U1.32(VCC)
$2N8038: R45.1 U1.22(CLKoutB0)

Not connected (* = marked no-connect by the designer): CEMX16_GOLD1 A5(JTAG2) A6(JTAG3) A7(JTAG4) A8(JTAG5) A19(RVSD5) A32(RVSD6) A33(RVSD7) A50(RVSD8) B9(JTAG1) B12(RVSD2) B30(RVSD3) B82(RVSD4); CN4 A5(JTAG2)* A6(JTAG3)* A7(JTAG4)* A8(JTAG5)* A19(RVSD)* A32(RVSD)* A33(RVSD)* B9(JTAG1)* B12(CLKREQ#)* B30(PWRBRK#)*; CN5 A5(JTAG2)* A6(JTAG3)* A7(JTAG4)* A8(JTAG5)* A19(RVSD)* A32(RVSD)* A33(RVSD)* B5(SMBCLK)* B6(SMBDAT)* B9(JTAG1)* B12(CLKREQ#)* B30(PWRBRK#)*; U1 3(CLKoutA0)* 4(CLKoutA0*)* 6(CLKoutA1)* 7(CLKoutA1*)* 11(OSCin)* 12(OSCout)* 25(NC)* 26(CLKin1*)* 27(CLKin1)* 29(REFout)*
